# Altium schematic sheet LEDs etc.SchDoc
size A4; Organization: Altium Limited; Address1: L3, 12a Rodborough Rd; Address2: Frenchs Forest; Address3: NSW; Address4: Australia 2086
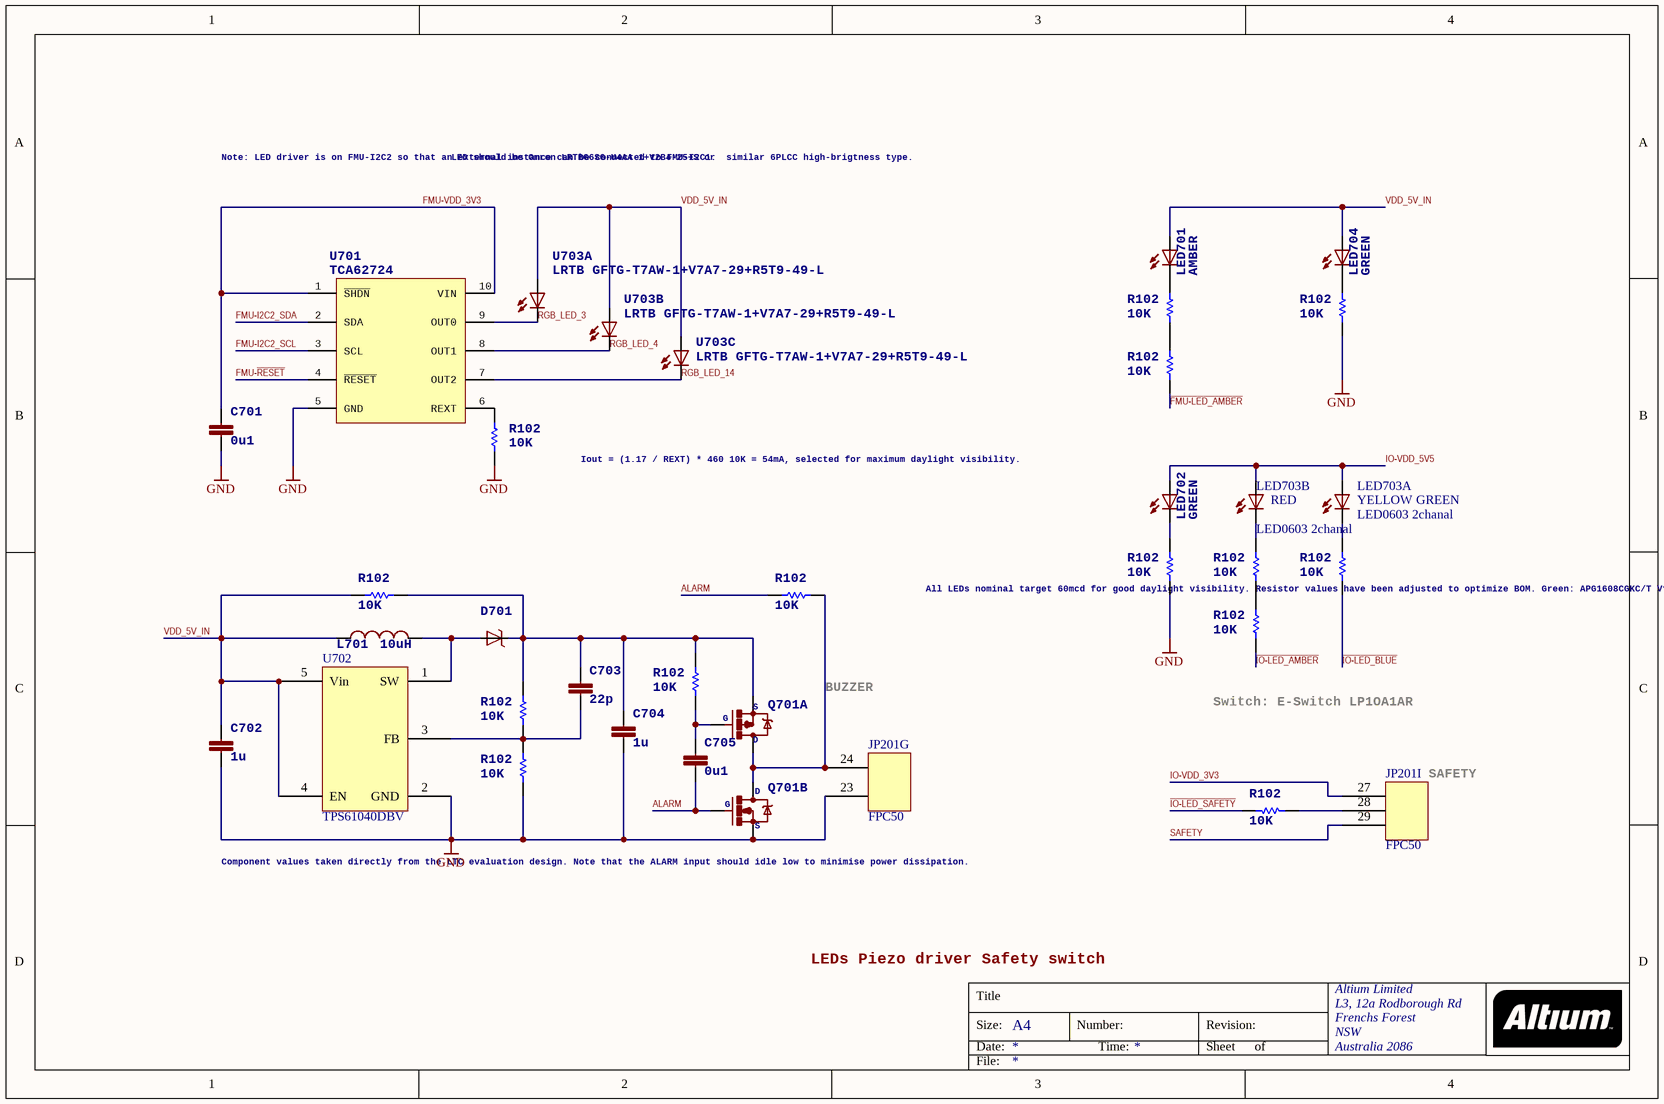
[diagram p0: LEDs etc.SchDoc]

## Parts
C701  >NAME: C701  [0603-CAP]  (hidden comment: 0u1)
C702  >NAME: C702  [0603-CAP]  (hidden comment: 1u)
C703  >NAME: C703  [0603-CAP]  (hidden comment: 22p)
C704  >NAME: C704  [0603-CAP]  (hidden comment: 1u)
C705  >NAME: C705  [0603-CAP]  (hidden comment: 0u1)
D701  SS14 SOD323  [SOD323]  (value not drawn)
JP201  FPC50  [FPC-0.5-50下接带锁]  (parts G,I of 16)
L701  >NAME: L701  [0805-IND]  (hidden comment: 10uH)
LED701  >NAME: LED701  [0603-LED]  (hidden comment: AMBER)
LED702  >NAME: LED702  [0603-LED]  (hidden comment: GREEN)
LED703  LED0603 2chanal  [LED0603 2chanal]  (parts A,B of 2)
LED704  >NAME: LED704  [0603-LED]  (hidden comment: GREEN)
Q701  NX3008CBKS  [SOT363-6]  (value not drawn)  (parts A,B of 2)
R701  >NAME: R102  [0603-RES]  (hidden comment: 10K)
R702  >NAME: R102  [0603-RES]  (hidden comment: 10K)
R703  >NAME: R102  [0603-RES]  (hidden comment: 10K)
R704  >NAME: R102  [0603-RES]  (hidden comment: 10K)
R705  >NAME: R102  [0603-RES]  (hidden comment: 10K)
R706  >NAME: R102  [0603-RES]  (hidden comment: 10K)
R707  >NAME: R102  [0603-RES]  (hidden comment: 10K)
R708  >NAME: R102  [0603-RES]  (hidden comment: 10K)
R709  >NAME: R102  [0603-RES]  (hidden comment: 10K)
R710  >NAME: R102  [0603-RES]  (hidden comment: 10K)
R711  >NAME: R102  [0603-RES]  (hidden comment: 10K)
R712  >NAME: R102  [0603-RES]  (hidden comment: 10K)
R735  >NAME: R102  [0603-RES]  (hidden comment: 10K)
R736  >NAME: R102  [0603-RES]  (hidden comment: 10K)
U701  >NAME: U701  [SON10]  (hidden comment: TCA62724FMG)
U702  TPS61040DBV  [SOT23-5]
U703  LRTB GFTG-T7AW-1+V7A7-29+R5T9-49-L  [6-PLCC]  (parts A,B,C of 3)

## Nets
GND: C701.P$2 C702.P$2 C704.P$2 JP201.23 Q701.1(S) R703.P$2 R704.P$1 R708.P$1 R711.P$1 U701.5(GND) U702.2(GND)
ALARM: C705.P$2 Q701.2(G) R706.P$2
~{FMU-LED_AMBER}: R707.P$1
FMU-I2C2_SCL: U701.3(SCL)
FMU-I2C2_SDA: U701.2(SDA)
FMU-~{RESET}: U701.4(~{RESET})
FMU-VDD_3V3: C701.P$1 U701.1(~{SHDN}) U701.10(VIN)
~{IO-LED_AMBER}: R709.P$1
~{IO-LED_BLUE}: R712.P$1
~{IO-LED_SAFETY}: R710.P$2
IO-VDD_3V3: JP201.27
IO-VDD_5V5: LED702.A LED703.3(A) LED703.4(A)
RGB_LED_3: U701.9(OUT0) U703.C1(C)
RGB_LED_4: U701.8(OUT1) U703.C2(C)
RGB_LED_14: U701.7(OUT2) U703.C3(C)
SAFETY: JP201.29
VDD_5V_IN: C702.P$1 L701.P$1 LED701.A LED704.A R705.P$2 U702.4(EN) U702.5(Vin) U703.A1(A) U703.A2(A) U703.A3(A)
NetC703_P$1: C703.P$1 C704.P$1 D701.C Q701.4(S) R701.P$1 R702.P$1 R705.P$1
NetC703_P$2: C703.P$2 R702.P$2 R703.P$1 U702.3(FB)
NetC705_P$1: C705.P$1 Q701.5(G) R701.P$2
NetD701_A: D701.A L701.P$2 U702.1(SW)
NetJP201_24: JP201.24 Q701.3(D) Q701.6(D) R706.P$1
NetJP201_28: JP201.28 R710.P$1
NetLED701_C: LED701.C R735.P$2
NetLED702_C: LED702.C R708.P$2
NetLED703_1: LED703.1(C) R712.P$2
NetLED703_2: LED703.2(C) R736.P$2
NetLED704_C: LED704.C R711.P$2
NetR704_P$2: R704.P$2 U701.6(REXT)
NetR707_P$2: R707.P$2 R735.P$1
NetR709_P$2: R709.P$2 R736.P$1

## Notes on the sheet
- Note: LED driver is on FMU-I2C2 so
  that an external instance can be
  connected to FMU-I2C1.
- LED should be Omron LRTBG6SG-U4AA-1+V2B4-25+S or
  similar 6PLCC high-brigtness type.
- Iout = (1.17 / REXT) * 460
  10K = 54mA, selected for maximum
  daylight visibility.
- All LEDs nominal target 60mcd
  for good daylight visibility.
  Resistor values have been adjusted
  to optimize BOM.
  Green: APG1608CGKC/T
  Vf(typ): 2.1V
  Target If: 20mA
  Selected R: 220
  Cacluated If @ 5.5V: 15mA
  Amber: APT1608SECK
  Vf(typ): 2.1V
  Target If: 5mA
  Selected R: 440
  Cacluated If @ 5.5V: 8mA
  Blue: APT1608QBC/G
  Vf(typ): 3.3V
  Target If: 6.6mA
  Selected R: 220
  Cacluated If @ 5.5V: 10mA
- BUZZER
- Switch: E-Switch LP1OA1AR
- (near JP201) SAFETY
- (near Q701) Component values taken directly from
  the LTC evaluation design.
  Note that the ALARM input should idle
  low to minimise power dissipation.
- LEDs
  Piezo driver
  Safety switch
- Title
- Size:
- Date:
- A4
- Number:
- Time:
- Revision:
- Sheet
- of
- File:
- (in symbol LED0603 2chanal, part A) YELLOW GREEN
- (in symbol LED0603 2chanal, part B) RED

## Library data of the parts
C701 C705 = CAP0402: <b>Capacitor</b> / Standard 0603 ceramic capacitor, and 0.1" leaded capacitor.; PARTNO: CC0402ZRY5V7BB104; >VALUE: 0u1
C702 = CAP0603: <b>Capacitor</b> / Standard 0603 ceramic capacitor, and 0.1" leaded capacitor.; PARTNO: CC0603ZRY5V7BB105; >VALUE: 1u
C703 = CAP0402: <b>Capacitor</b> / Standard 0603 ceramic capacitor, and 0.1" leaded capacitor.; PARTNO: C0402C562K5RACTU; >VALUE: 22p
C704 = CAP0402: <b>Capacitor</b> / Standard 0603 ceramic capacitor, and 0.1" leaded capacitor.; PARTNO: C1005X5R1C474K050BC; >VALUE: 1u
D701 = DIODE-SCHOTTKY_MSMP: Schottky barrier diode in DO214AC, e.g. Fairchild SS14.
L701 = INDUCTOR0805: <b>Inductors</b> / Basic Inductor/Choke - 0603 and 1210. Footprints are not proven and vary greatly between part numbers. / SRR1210: Bourns SRR1210 parts, e.g. SRR1210-100M; PARTNO: MLZ2012M470W; >VALUE: 10uH
LED701 = LED0603: <b>LEDs</b> / Standard schematic elements and footprints for 5mm, 3mm, 1206, and 0603 sized LEDs. 5mm - Spark Fun Electronics SKU : COM-00529 (and others); PARTNO: APTD1608SECK; >VALUE: AMBER
LED702 LED704 = LED0603: <b>LEDs</b> / Standard schematic elements and footprints for 5mm, 3mm, 1206, and 0603 sized LEDs. 5mm - Spark Fun Electronics SKU : COM-00529 (and others); PARTNO: APTD1608CGCK; >VALUE: GREEN
Q701 = N/PCHANNEL-Complementary-MOSFET: PARTNO: NTHD4102PT1G; D: D; S: S; G: G
R701-R712 R735 R736 = RESISTOR0402-RES: <b>Resistor</b> / Basic schematic elements and footprints for 0603, 1206, and PTH 1/10th watt (small) resistors.; PARTNO: RC0402FR-0710KL; >VALUE: 10K
U701 = TCA62724FMG: Toshiba TCA62724FMG I2C RGB LED driver; PARTNO: TCA62724FMG; TCA62724: TCA62724
U702 = TPS61040: Boost
U703 = RGB-LED6-PLCC: RGB LED with separate anode/cathode terminals; PARTNO: LRTB GFTG-T7AW-1+V7A7-29+R5T9-49-L